# Altium project PCB_Project1.PrjPCB
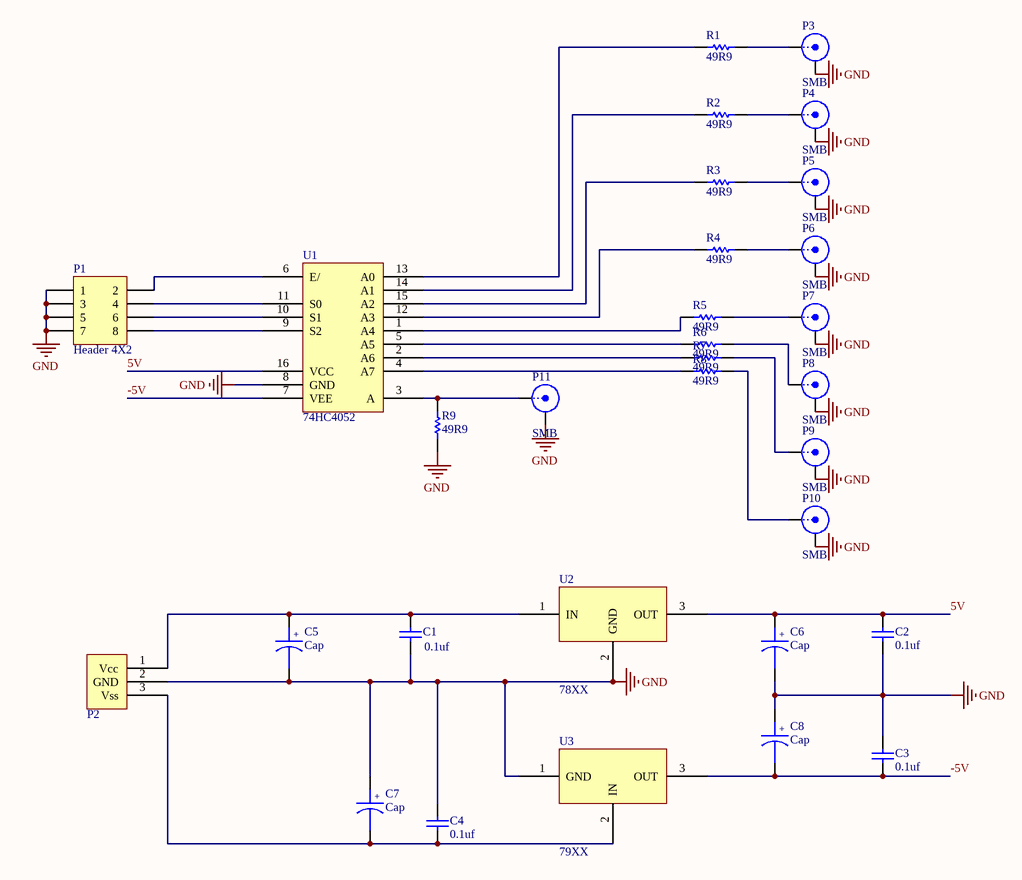
[diagram p0: Sheet1.SchDoc]
1 sheet, 31 parts. Net scope: global (net labels, ports and power ports of the same name join across sheets).
Board file: PCB1.PcbDoc

## Sheet Sheet1.SchDoc
size A4

### Parts
C1  0.1uf  [0805]
C2  0.1uf  [0805]
C3  0.1uf  [0805]
C4  0.1uf  [0805]
C5  Cap  [3216C-TYPE_A]
C6  Cap  [3216C-TYPE_A]
C7  Cap  [3216C-TYPE_A]
C8  Cap  [3216C-TYPE_A]
P1  Header 4X2  [HDR2X4]
P2  XH2.54-3p  [XH2.54-3p]  (value not drawn)
P3  SMB  [SMB_V-RJ45]
P4  SMB  [SMB_V-RJ45]
P5  SMB  [SMB_V-RJ45]
P6  SMB  [SMB_V-RJ45]
P7  SMB  [SMB_V-RJ45]
P8  SMB  [SMB_V-RJ45]
P9  SMB  [SMB_V-RJ45]
P10  SMB  [SMB_V-RJ45]
P11  SMB  [SMB_V-RJ45]
R1  49R9  [0805]
R2  49R9  [0805]
R3  49R9  [0805]
R4  49R9  [0805]
R5  49R9  [0805]
R6  49R9  [0805]
R7  49R9  [0805]
R8  49R9  [0805]
R9  49R9  [0805]
U1  74HC4052  [TI-D16_L]
U2  78XX  [TO-220]
U3  79XX  [TO-220]

### Nets
GND: C1.1 C2.1 C3.1 C4.2 C5.2 C6.2 C7.1 C8.1 P1.1 P1.3 P1.5 P1.7 P2.2(GND) P3.2(Y) P4.2(Y) P5.2(Y) P6.2(Y) P7.2(Y) P8.2(Y) P9.2(Y) P10.2(Y) P11.2(Y) R9.1 U1.8(GND) U2.2(GND) U3.1(GND)
5V: C2.2 C6.1 U1.16(VCC) U2.3(OUT)
-5V: C3.2 C8.2 U1.7(VEE) U3.3(OUT)
NetC1_2: C1.2 C5.1 P2.1(Vcc) U2.1(IN)
NetC4_1: C4.1 C7.2 P2.3(Vss) U3.2(IN)
NetP1_2: P1.2 U1.6(E/)
NetP1_4: P1.4 U1.11(S0)
NetP1_6: P1.6 U1.10(S1)
NetP1_8: P1.8 U1.9(S2)
NetP3_1: P3.1(X) R1.2
NetP4_1: P4.1(X) R2.2
NetP5_1: P5.1(X) R3.2
NetP6_1: P6.1(X) R4.2
NetP7_1: P7.1(X) R5.2
NetP8_1: P8.1(X) R6.2
NetP9_1: P9.1(X) R7.2
NetP10_1: P10.1(X) R8.2
NetP11_1: P11.1(X) R9.2 U1.3(A)
NetR1_1: R1.1 U1.13(A0)
NetR2_1: R2.1 U1.14(A1)
NetR3_1: R3.1 U1.15(A2)
NetR4_1: R4.1 U1.12(A3)
NetR5_1: R5.1 U1.1(A4)
NetR6_1: R6.1 U1.5(A5)
NetR7_1: R7.1 U1.2(A6)
NetR8_1: R8.1 U1.4(A7)

### Notes on the sheet
- (in symbol Tantalium Cap) +
- (in symbol Cap) +

### Library data of the parts
C1-C4 = Cap
C5-C8 = Tantalium Cap
P1 = Header 4X2: Header, 4-Pin, Dual row; LatestRevisionDate: 17-Jul-2002; LatestRevisionNote: Re-released for DXP Platform.; Publisher: Altium Limited
P3-P11 = SMB: SMB Straight Connector; LatestRevisionDate: 17-Jul-2002; LatestRevisionNote: Re-released for DXP Platform.; Publisher: Altium Limited
R1-R9 = Res